# Altium schematic sheet Block diagram.SchDoc
size A
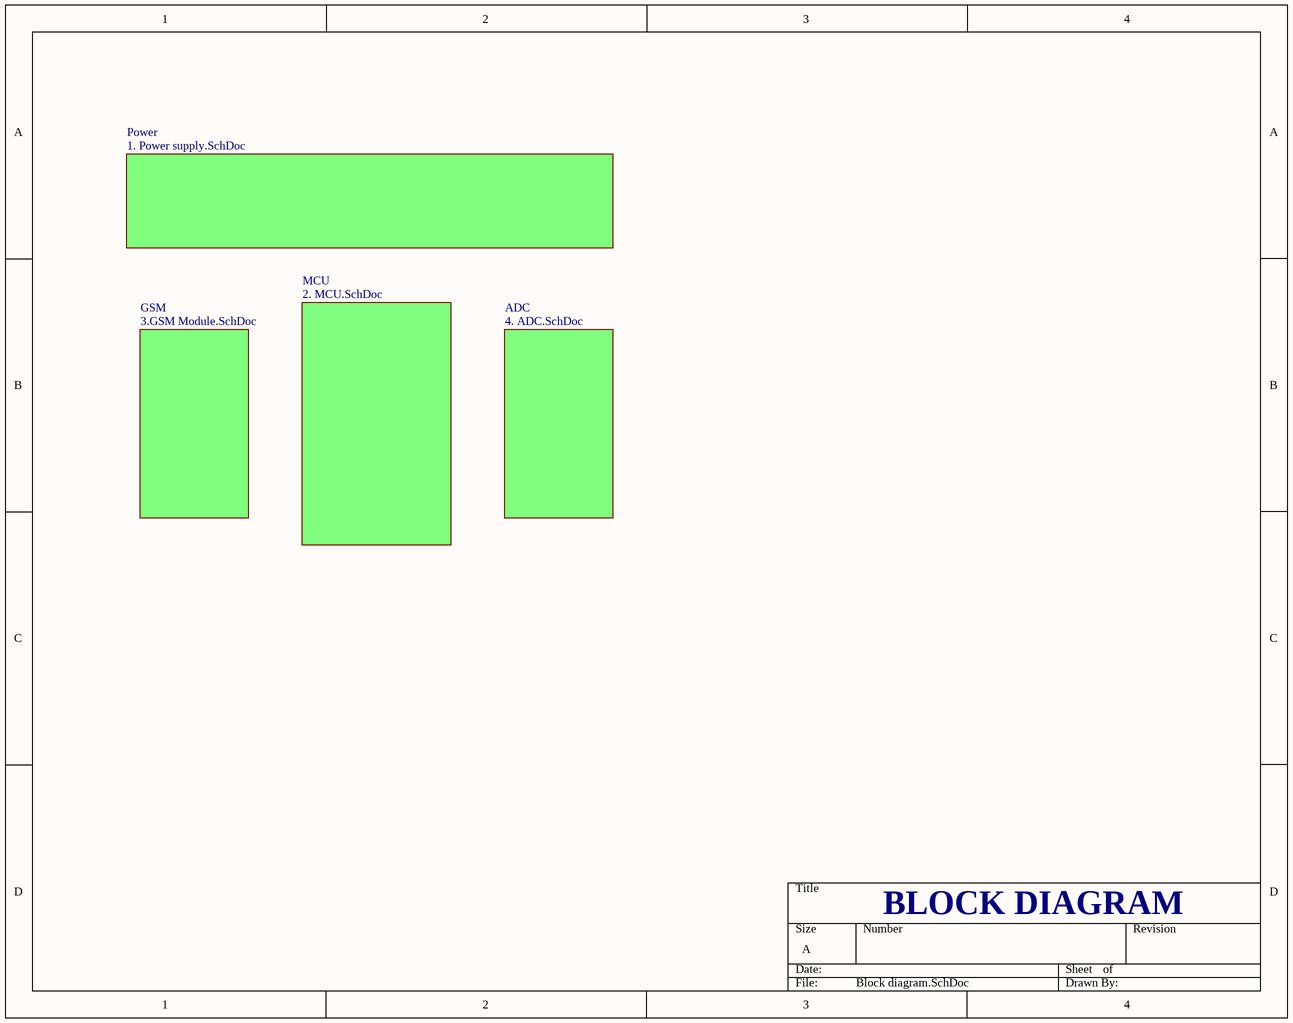
[diagram p0: Block diagram.SchDoc]

## Sub-sheets
ADC = 4. ADC.SchDoc: no entries
GSM = 3.GSM Module.SchDoc: no entries
MCU = 2. MCU.SchDoc: no entries
Power = 1. Power supply.SchDoc: no entries

## Notes on the sheet
- BLOCK DIAGRAM